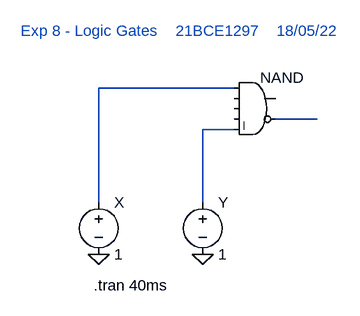
[diagram p0: schematic AND_NAND.asc]
AND_NAND.asc, the LTspice schematic file:
Version 4
SHEET 1 880 680
WIRE 304 32 96 32
WIRE 432 80 368 80
WIRE 304 96 256 96
WIRE 96 208 96 32
WIRE 256 208 256 96
FLAG 96 288 0
FLAG 256 288 0
SYMBOL Digital\\and 336 0 R0
SYMATTR InstName NAND
SYMBOL voltage 96 192 R0
SYMATTR InstName X
SYMATTR Value 1
SYMBOL voltage 256 192 R0
SYMATTR InstName Y
SYMATTR Value 1
TEXT 88 336 Left 2 !.tran 40ms
TEXT -24 -56 Left 2 ;Exp 8 - Logic Gates    21BCE1297    18/05/22

The netlist it stands for:
* AND_NAND.asc
A§NAND N001 0 0 0 N003 N002 0 0 AND
V§X N001 0 1
V§Y N003 0 1
.tran 40ms
* Exp 8 - Logic Gates    21BCE1297    18/05/22
.backanno
.end